# EAGLE schematic Smart Bird Feeder (EAGLE 9.6.2)
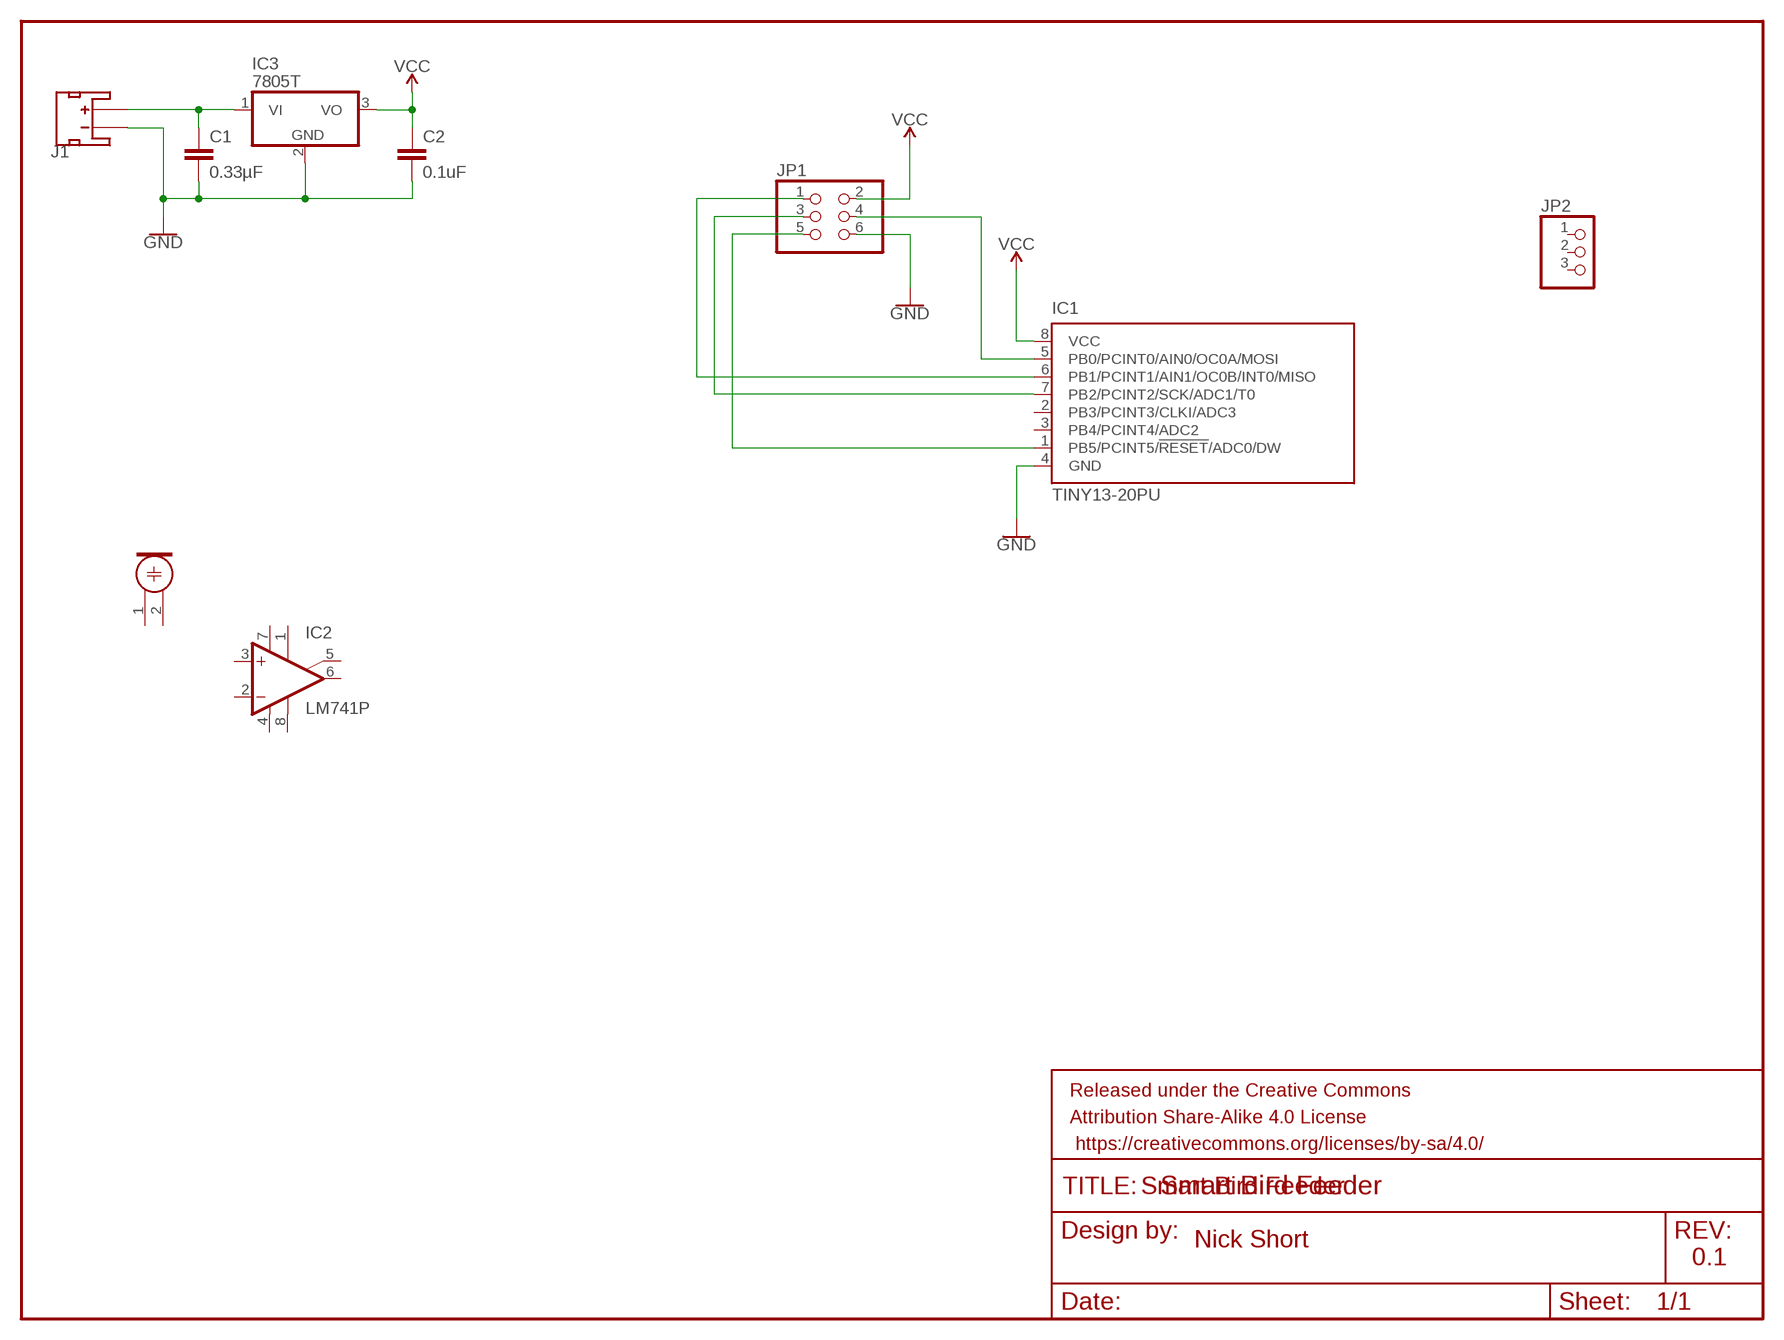
[diagram p0: schematic, sheet 1]

## Parts
C1  0.33µF  0.33UF/330NF-0805-50V-10%  [0805]
C2  0.1uF  0.1UF-0402-16V-10%  [0402]
FRAME1  FRAME-LETTERNO_PACKAGE  [DUMMY]
IC1  TINY13-20PU  [DIL08]
IC2  LM741P  [DIL08]
IC3  7805T  [TO220H]
J1  JST_2MM_MALE  [JST-2-SMD]
JP1  PINHD-2X3  [2X03]
JP2  PINHD-1X3/90  [1X03/90]
M1  ELECTRET_MICROPHON-WM-61A  [WM-61A]

## Nets
GND: C1.2 C2.2 IC1.4(GND) IC3.2(GND) J1.1(-) JP1.6
N$1: IC1.6(PB1/PCINT1/AIN1/OC0B/INT0/MISO) JP1.1
N$2: IC1.7(PB2/PCINT2/SCK/ADC1/T0) JP1.3
N$3: IC1.1(PB5/PCINT5/!RESET!/ADC0/DW) JP1.5
N$4: IC1.5(PB0/PCINT0/AIN0/OC0A/MOSI) JP1.4
N$5: C1.1 IC3.1(VI) J1.2(+)
VCC: C2.1 IC1.8(VCC) IC3.3(VO) JP1.2
Unconnected: IC1.2(PB3/PCINT3/CLKI/ADC3) IC1.3(PB4/PCINT4/ADC2) IC2.1(ON1) IC2.2(-IN) IC2.3(+IN) IC2.5(ON2) IC2.6(OUT) IC2.8(OPT) J1.NC1(PAD1) J1.NC2(PAD2) JP2.1 JP2.2 JP2.3 M1.1 M1.2

## Notes on the sheet
- Smart Bird Feeder
- Nick Short
- 0.1

## Power pins joined to a net without a drawn wire
V+: IC2.7(V+)
V-: IC2.4(V-)

## Library data of the parts
C1 = SparkFun-Capacitors:0.33UF/330NF: 0.33µF/330nF ceramic capacitors A capacitor is a passive two-terminal electrical component used to store electrical energy temporarily in an electric field.; PROD_ID: CAP-08469
C2 = SparkFun-Capacitors:0.1UF: 0.1µF ceramic capacitors A capacitor is a passive two-terminal electrical component used to store electrical energy temporarily in an electric field.; PROD_ID: CAP-12416
FRAME1 = SparkFun-Aesthetics:FRAME-LETTER: Schematic Frame - Letter Standard 8.5x11 US Letter frame; DESIGNER: Nobody; VERSION: v01
IC1 = atmel:TINY13: 8-bit AVR Microcontroller with 1K Bytes In-System Programmable Flash Source: http://www.atmel.com/dyn/resources/prod_documents/2535S.pdf; MPN: ATTINY13-20PU; OC_FARNELL: 9171550; OC_NEWARK: 96K6521
IC2 = linear:*741: OP AMP
IC3 = linear:78*: Positive VOLTAGE REGULATOR Source: http://cache.national.com/ds/LM/LM78L05.pdf http://www.fairchildsemi.com/ds/LM/LM7805.pdf
J1 = SparkFun-Connectors:JST_2MM_MALE: JST 2MM MALE RA CONNECTOR Two pin, compact surface mount connector. Commonly used as a battery input connection point. We really like the solid locking feeling and high current rating on these small connectors. We use these all the time as battery connectors. Mates to single-cell LiPo batteries. Here is the connector we sell at SparkFun: JST Right Angle Connector - White <https://www.sparkfun.com/products/8612> (PRT-08612) Datasheet <http://www.sparkfun.com/datasheets/Prototyping/Connectors/JST-Horizontal.pdf> It was used on these SparkFun products: SparkFun MOSFET Power Controller <https://www.sparkfun.com/products/11214> (PRT-11214) SparkFun Battery Babysitter - LiPo Battery Manager <https://www.sparkfun.com/products/13777> (PRT-13777) And many, many others that required a lipo battery connection.; PROD_ID: CONN-11443; SF_ID: PRT-08612
JP1 = pinhead:PINHD-2X3: PIN HEADER
JP2 = pinhead:PINHD-1X3: PIN HEADER
M1 = microphon:ELECTRET_MICROPHON-: Electret Condenser Microphone